# EasyEDA Pro project PCB_TOAST_2025-10-05.eprj

# Board PCB_TOAST_2025-10-05
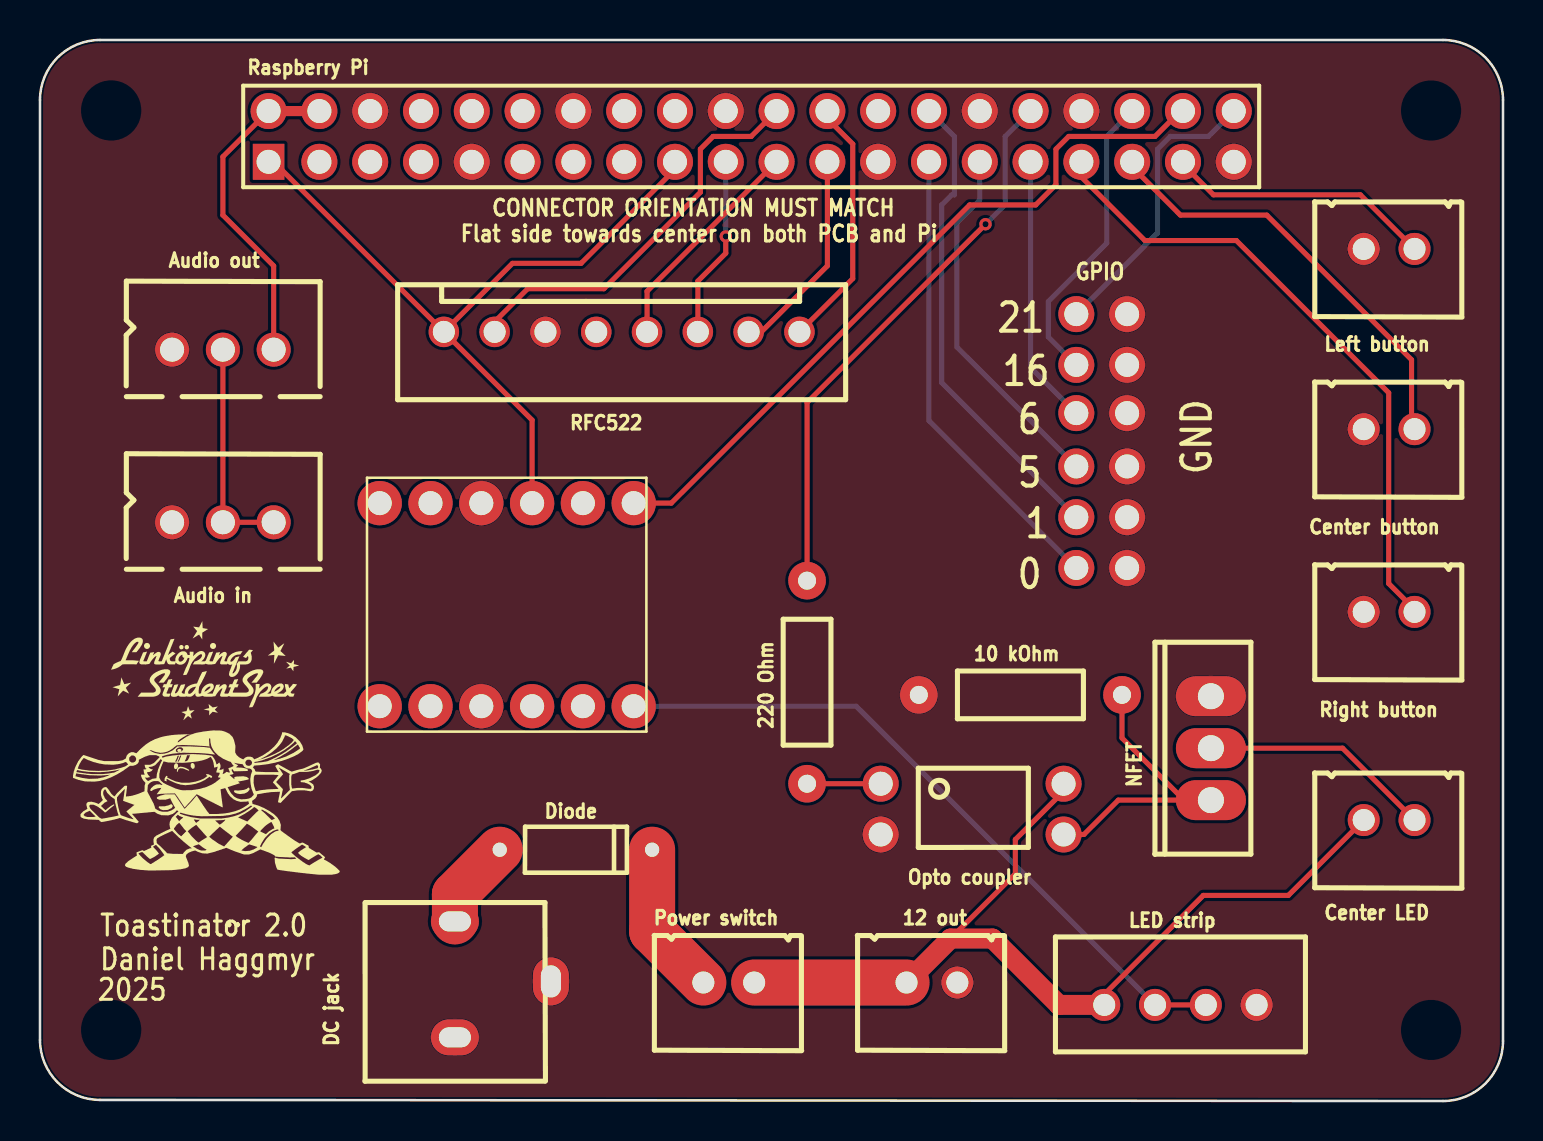
[diagram p0: board, top side]
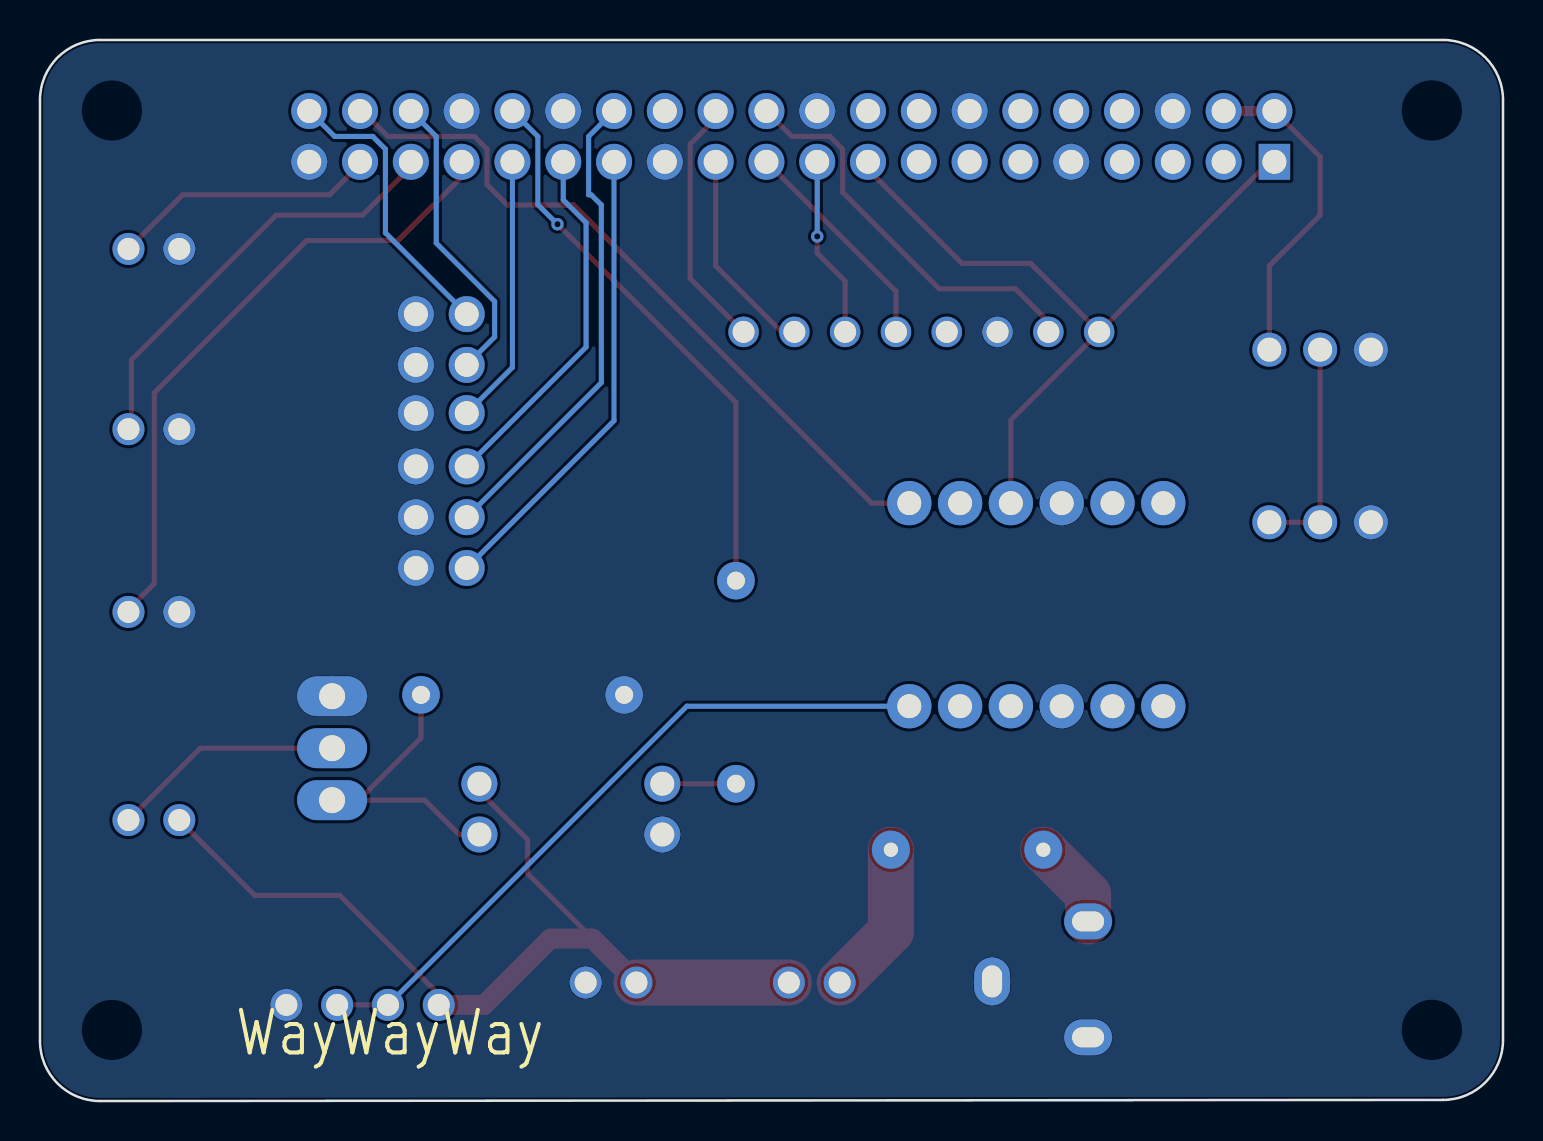
[diagram p1: board, bottom side, seen from below]

Outline 73.15 x 53.09 mm; copper layers: Top Layer, Bottom Layer. Coordinates in mm from the lower left corner of the outline.
Outline path: 0,50.09 0,3.06 arc(0.88,0.93) 3,0.06 70.15,0 arc(72.27,0.88) 73.15,3 73.15,50.09 arc(72.27,52.21) 70.15,53.09 3,53.09 arc(0.88,52.21) 0,50.09
Stack: Top Layer 0.035mm / Dielectric1 1.51mm FR4 er 4.5 / Bottom Layer 0.035mm

## Design rules (mm)
spacing Default (default): track to track 0.152, other pairs 0 to 0.152
track width Default (default): min 0.254, default 0.254, max 25.4
differential pair differentialPair (default): width min 0.127, default 0.254, max 2.54; gap min 0.152, default 0.152
via Default (default): diameter min 0.61, default 0.61, max 100.025; hole min 0.305, default 0.305, max 59.995

## Placement (name value [footprint] x y rotation side)
10 kOhm  -  [AXIAL-0.4]  49.02 20.32 0 top
12 out  _  [_#2]  44.58 6.35 0 top
220 Ohm  -  [AXIAL-0.4]  38.35 20.96 90 top
Audio in  -  [JST-XH-TH-3-2.54]  6.6 28.96 0 top
Audio out  -  [JST-XH-TH-3-2.54]  6.6 37.59 0 top
Center button  _  [_#2]  67.44 34.04 0 top
Center LED  _  [_#2]  67.44 14.48 0 top
DC jack  -  [_]  19.69 2.67 90 top
Diode  -  [DIODE]  26.8 12.57 0 top
LED strip  _  [_#3]  57.02 5.33 180 top
Left button  _  [_#2]  67.44 43.05 0 top
NFET  -  [TIP121]  58.55 17.65 90 top
NONE  _  [_#4]  24.38 23.62 180 top
NOREF  -  [Pad_e415]  54.36 31.75 0 top
NOREF#2  -  [Pad_e417]  54.36 26.67 0 top
NOREF#3  -  [Pad_e412]  54.36 39.37 0 top
NOREF#4  -  [Pad_e416]  54.36 29.21 0 top
NOREF#5  -  [Pad_e409]  51.82 31.75 0 top
NOREF#6  -  [Pad_e413]  54.36 36.83 0 top
NOREF#7  -  [Pad_e414]  54.36 34.42 0 top
NOREF#8  -  [Pad_e411]  51.82 29.21 0 top
NOREF#9  -  [Pad_e406]  51.82 39.37 0 top
NOREF#10  -  [Pad_e408]  51.82 34.42 0 top
NOREF#11  -  [Pad_e410]  51.82 26.67 0 top
NOREF#12  -  [Pad_e407]  51.82 36.83 0 top
Opto coupler  -  [DIP-OPTO-4P-(6.5X4.6)]  47.12 14.61 0 top
Power switch  _  [_#2]  34.42 6.35 0 top
Raspberry Pi  2.54mm 2*20P  [HDR-TH_40P-P2.54-V-M-R2-C20-S2.54]  35.56 48.26 0 top
RFC522  -  [JST-XH-08-PACKAGE-ROUND-PAD]  29.08 38.48 180 top
Right button  _  [_#2]  67.44 24.89 0 top

## Footprints (pads in the part's own frame, mm; a bottom-side part is the same pattern mirrored in y, then rotated)
_
  oval 1.8x2.4 hole 1x1.6: 1(6.319,-1.061) 2(0.518,-1.061)
  oval 2.4x1.8 hole 1.6x1: 3(3.318,-5.862)
_#2
  round 1.6 hole 1.1: 1(-1.248,-0.421) 1(1.292,-0.421)
_#3
  round 1.6 hole 1.1: 27(-3.811,0.525) 27(-1.27,0.524) 27(1.27,0.524) 27(3.809,0.524)
_#4
  round 2.216 hole 1.2: HGND(2.318,3.869) HV1(-5.303,3.869) HV2(-2.763,3.869) HV3(4.858,3.869) HV4(7.398,3.869) HVCC(-0.223,3.869) LGND(2.318,-6.292) LV1(-5.303,-6.292) LV2(-2.763,-6.292) LV3(4.858,-6.292) LV4(7.398,-6.292) LVCC(-0.223,-6.292)
AXIAL-0.4
  round 1.879 hole 0.899: 1(-5.08,0) 2(5.08,0)
DIODE
  round 1.905 hole 0.711: A(-3.81,0) C(3.81,0)
DIP-OPTO-4P-(6.5X4.6)
  round 1.8 hole 1.2: 1(-5.08,1.27) 2(-5.08,-1.27) 3(4.064,-1.27) 4(4.064,1.27)
HDR-TH_40P-P2.54-V-M-R2-C20-S2.54
  rect 1.575x1.8 hole 1.2: 1(-24.13,-1.27)
  round 1.8 hole 1.2: 2(-24.13,1.27) 3(-21.59,-1.27) 4(-21.59,1.27) 5(-19.05,-1.27) 6(-19.05,1.27) 7(-16.51,-1.27) 8(-16.51,1.27) 9(-13.97,-1.27) 10(-13.97,1.27) 11(-11.43,-1.27) 12(-11.43,1.27) 13(-8.89,-1.27) 14(-8.89,1.27) 15(-6.35,-1.27) 16(-6.35,1.27) 17(-3.81,-1.27) 18(-3.81,1.27) 19(-1.27,-1.27) 20(-1.27,1.27) 21(1.27,-1.27) 22(1.27,1.27) 23(3.81,-1.27) 24(3.81,1.27) 25(6.35,-1.27) 26(6.35,1.27) 27(8.89,-1.27) 28(8.89,1.27) 29(11.43,-1.27) 30(11.43,1.27) 31(13.97,-1.27) 32(13.97,1.27) 33(16.51,-1.27) 34(16.51,1.27) 35(19.05,-1.27) 36(19.05,1.27) 37(21.59,-1.27) 38(21.59,1.27) 39(24.13,-1.27) 40(24.13,1.27)
JST-XH-08-PACKAGE-ROUND-PAD
  round 1.524 hole 1.1: 1(-8.89,0) 2(-6.35,0) 3(-3.81,0) 4(-1.27,0) 5(1.27,0) 6(3.81,0) 7(6.35,0) 8(8.89,0)
JST-XH-TH-3-2.54
  round 1.7 hole 1.2x1.1: 1(0,0) 2(2.54,0) 3(5.08,0)
Pad_e406
  round 1.8 hole 1.2: 1(0,0)
Pad_e407
  round 1.8 hole 1.2: 2(0,0)
Pad_e408
  round 1.8 hole 1.2: 3(0,0)
Pad_e409
  round 1.8 hole 1.2: 4(0,0)
Pad_e410
  round 1.8 hole 1.2: 5(0,0)
Pad_e411
  round 1.8 hole 1.2: 6(0,0)
Pad_e412
  round 1.8 hole 1.2: 7(0,0)
Pad_e413
  round 1.8 hole 1.2: 8(0,0)
Pad_e414
  round 1.8 hole 1.2: 9(0,0)
Pad_e415
  round 1.8 hole 1.2: 10(0,0)
Pad_e416
  round 1.8 hole 1.2: 11(0,0)
Pad_e417
  round 1.8 hole 1.2: 12(0,0)
TIP121
  oval 2x3.5 hole 1.3: 1(-2.6,0) 2(0,0) 3(2.6,0)

## Nets
3.3V: NONE.LVCC Raspberry Pi.1 Raspberry Pi.17 RFC522.8
+5V: Audio out.3 Raspberry Pi.2 Raspberry Pi.4
GND: 10 kOhm.1 Audio in.1 Audio out.1 Center button.1 DC jack.2 DC jack.3 Left button.1 NFET.3 NONE.HGND NONE.LGND NOREF.10 NOREF#2.12 NOREF#3.7 NOREF#4.11 NOREF#6.8 NOREF#7.9 Opto coupler.2 Raspberry Pi.6 Raspberry Pi.9 Raspberry Pi.14 Raspberry Pi.20 Raspberry Pi.25 Raspberry Pi.30 Raspberry Pi.34 Raspberry Pi.39 RFC522.6 Right button.1
4: 12 out.1 Center LED.1 LED strip.27 Opto coupler.4
N$65759: Raspberry Pi.22 RFC522.7
N$65814: Raspberry Pi.21 RFC522.4
N$65821: Raspberry Pi.19 RFC522.3
N$65834: Raspberry Pi.23 RFC522.2
N$65841: Raspberry Pi.24 RFC522.1
N$65848: NONE.LV1 Raspberry Pi.38
N$67106: NONE.HV1
N$67811: Audio in.2 Audio in.3 Audio out.2
N$67836: 220 Ohm.2 Raspberry Pi.32
N$67867: Raspberry Pi.33
N$71388: DC jack.1 Diode.A
N$71395: Diode.C Power switch.1
N$93319: NOREF#9.1 Raspberry Pi.40
N$93326: NOREF#12.2 Raspberry Pi.36
N$93333: NOREF#10.3 Raspberry Pi.31
N$93340: NOREF#5.4 Raspberry Pi.29
N$93347: NOREF#11.5 Raspberry Pi.27
N$93354: NOREF#8.6 Raspberry Pi.28
S$57205: NFET.2
S$57212: 10 kOhm.2 NFET.1 Opto coupler.3
S$57225: 220 Ohm.1 Opto coupler.1
S$65635: Raspberry Pi.18
SCL: Raspberry Pi.35
SDA: Raspberry Pi.37

Pads without a net: NONE HV2 HV3 HV4 HVCC LV2 LV3 LV4; Raspberry Pi 3 5 7 8 10 11 12 13 15 16 26; RFC522 5

## Via types
v1: diameter 0.62, hole 0.31, Top Layer to Bottom Layer, 2 vias

## Routing (per net, layer and track width the routed paths; a pad name or vN(x,y) marks a point on that pad's centre or on a via; arc(x,y) is an arc through that point)
3.3V: length 38
  Top Layer w0.254: NONE.LVCC 24.61,34.07 20.19,38.48 ; 20.19,38.48 11.68,46.99 Raspberry Pi.1 ; 20.19,38.48 23.62,41.91 27.05,41.91 31.75,46.61 Raspberry Pi.17
+5V: length 16.5
  Top Layer w0.254: Audio out.3 11.68,41.78 9.14,44.32 9.14,47.24 11.43,49.53
  Top Layer w0.508: 11.43,49.53 13.97,49.53
4: length 47.1
  Top Layer w0.254: LED strip.27 53.21,5.33 58.17,10.29 62.42,10.29 Center LED.1 ; 51.56,15.88 48.77,13.08 48.77,11.37 45.53,8.13
  Top Layer w1: LED strip.27 50.94,4.81 47.62,8.13 45.53,8.13 12 out.1
  Top Layer w2.3: 35.71,5.93 12 out.1
N$65759: length 20.2
  Top Layer w0.254: RFC522.7 22.73,38.99 24.38,40.64 28.19,40.64 33.02,45.47 33.02,47.63 33.66,48.26 35.56,48.26 36.83,49.53
N$65814: length 11.2
  Top Layer w0.254: Raspberry Pi.21 30.35,40.51 RFC522.4
N$65821: length 9.1
  Top Layer w0.254: v1(34.29,43.26) 34.29,42.42 32.89,41.02 RFC522.3
  Bottom Layer w0.254: v1(34.29,43.26) Raspberry Pi.19
N$65834: length 10.5
  Top Layer w0.254: Raspberry Pi.23 39.37,41.78 36.07,38.48 RFC522.2
N$65841: length 12.7
  Top Layer w0.254: 39.37,49.53 39.37,49.15 40.64,47.88 40.64,41.15 RFC522.1
N$65848: length 36.6
  Top Layer w0.254: 29.69,29.91 31.56,29.91 46.48,44.83 49.78,44.83 50.8,45.85 50.8,47.63 51.44,48.26 55.75,48.26 57.02,49.53 57.15,49.53
N$67106: length 34.8
  Top Layer w0.254: 55.75,4.81 58.29,4.81
  Bottom Layer w0.254: 55.75,4.81 40.81,19.75 NONE.HV1
N$67811: length 11.2
  Top Layer w0.254: Audio in.3 Audio in.2 Audio out.2
N$67836: length 28.1
  Top Layer w0.254: v1(47.28,43.87) 38.35,34.95 220 Ohm.2
  Bottom Layer w0.254: 49.53,49.53 48.26,48.26 48.26,44.85 v1(47.28,43.87)
N$67867: length 32.1
  Top Layer w0.254: 68.85,24.47 67.44,25.89 67.44,35.43 59.82,43.05 55.25,43.05 52.07,46.23 Raspberry Pi.33
N$71388: length 4.5
  Top Layer w2.3: DC jack.1 20.75,10.33 Diode.A
N$71395: length 7.7
  Top Layer w2.3: Power switch.1 30.61,8.49 Diode.C
N$93319: length 14.5
  Bottom Layer w0.254: 59.69,49.53 58.42,48.26 56.51,48.26 55.88,47.63 55.88,43.43 NOREF#9.1
N$93326: length 15
  Bottom Layer w0.254: 54.61,49.53 53.34,48.26 53.34,42.93 50.42,40.01 50.42,38.23 NOREF#12.2
N$93333: length 13.5
  Bottom Layer w0.254: Raspberry Pi.31 49.53,36.7 NOREF#10.3
N$93340: length 18.2
  Bottom Layer w0.254: NOREF#5.4 45.85,37.72 45.85,43.94 46.99,45.09 Raspberry Pi.29
N$93347: length 23.4
  Bottom Layer w0.254: Raspberry Pi.27 44.45,34.04 NOREF#11.5
N$93354: length 24
  Bottom Layer w0.254: NOREF#8.6 45.09,35.94 45.09,44.83 45.59,45.34 45.72,45.34 45.72,48.26 44.45,49.53
S$57205: length 11.7
  Top Layer w0.254: NFET.2 65.13,17.65 68.73,14.06
S$57212: length 14.6
  Top Layer w0.254: Opto coupler.3 52.2,13.34 53.91,15.05 57.21,15.05 ; 10 kOhm.2 54.1,18.16 57.21,15.05 ; 57.21,15.05 NFET.1
S$57225: length 3.7
  Top Layer w0.254: 220 Ohm.1 Opto coupler.1
SCL: length 21.8
  Top Layer w0.254: 68.73,33.61 68.58,33.76 68.58,37.08 61.34,44.32 57.02,44.32 54.61,46.74 Raspberry Pi.35
SDA: length 13.5
  Top Layer w0.254: Raspberry Pi.37 57.15,46.86 58.67,45.34 66.02,45.34 68.73,42.63

## Copper pours and planes (outline as drawn; the poured copper is in the pictures)
GND on Top Layer: -0.64,53.98 74.29,53.98 74.29,-1.52 -0.64,-1.52
GND on Bottom Layer: -2.67,55.5 75.82,55.5 75.82,-2.16 -2.67,-2.16

## Text on the board
Bottom Silkscreen Layer: WayWayWay
Top Silkscreen Layer: GPIO | CONNECTOR ORIENTATION MUST MATCH / Flat side towards center on both PCB and Pi | 2025 | Toastinator 2.0 / Daniel Haggmyr | .. | 21 | 16 | 6 | 5 | 0 | 1 | GND
